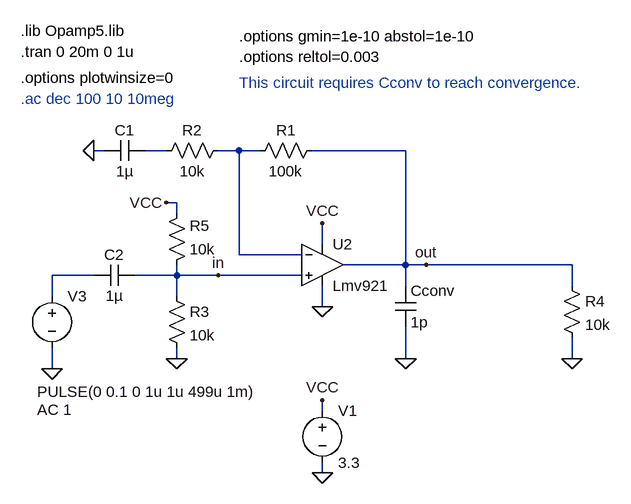
[diagram p0: schematic lmv921_test.asc]
lmv921_test.asc, the LTspice schematic file:
Version 4
SHEET 1 924 680
WIRE -224 0 -240 0
WIRE -128 0 -160 0
WIRE -16 0 -48 0
WIRE 16 0 -16 0
WIRE 240 0 96 0
WIRE -112 80 -128 80
WIRE -112 96 -112 80
WIRE 112 144 112 112
WIRE -16 160 -16 0
WIRE 80 160 -16 160
WIRE 240 176 240 0
WIRE 240 176 144 176
WIRE 272 176 240 176
WIRE 496 176 272 176
WIRE -240 192 -304 192
WIRE -112 192 -112 176
WIRE -112 192 -176 192
WIRE -48 192 -112 192
WIRE 80 192 -48 192
WIRE 240 208 240 176
WIRE 496 208 496 176
WIRE -304 224 -304 192
WIRE -112 224 -112 192
WIRE 112 240 112 208
WIRE -112 320 -112 304
WIRE 240 320 240 272
WIRE 496 320 496 288
WIRE -304 336 -304 304
WIRE 112 400 112 384
WIRE 112 496 112 480
FLAG 112 112 VCC
FLAG -304 336 0
FLAG 112 496 0
FLAG 112 384 VCC
FLAG 272 176 out
FLAG 496 320 0
FLAG -240 0 0
FLAG 112 240 0
FLAG -112 320 0
FLAG -128 80 VCC
FLAG -48 192 in
FLAG 240 320 0
SYMBOL voltage 112 384 R0
SYMATTR InstName V1
SYMATTR Value 3.3
SYMBOL res 0 16 R270
WINDOW 0 32 56 VTop 0
WINDOW 3 0 56 VBottom 0
SYMATTR InstName R1
SYMATTR Value 100k
SYMBOL res -144 16 R270
WINDOW 0 32 56 VTop 0
WINDOW 3 0 56 VBottom 0
SYMATTR InstName R2
SYMATTR Value 10k
SYMBOL voltage -304 208 R0
WINDOW 3 -23 163 Left 0
WINDOW 123 -23 191 Left 0
WINDOW 39 0 0 Left 0
SYMATTR Value PULSE(0 0.1 0 1u 1u 499u 1m)
SYMATTR Value2 AC 1
SYMATTR InstName V3
SYMBOL res 480 192 R0
SYMATTR InstName R4
SYMATTR Value 10k
SYMBOL cap -224 16 R270
WINDOW 0 32 32 VTop 0
WINDOW 3 0 32 VBottom 0
SYMATTR InstName C1
SYMATTR Value 1µ
SYMBOL res -128 192 M180
WINDOW 0 36 76 Left 0
WINDOW 3 36 40 Left 0
SYMATTR InstName R5
SYMATTR Value 10k
SYMBOL cap -240 208 R270
WINDOW 0 32 32 VTop 0
WINDOW 3 0 32 VBottom 0
SYMATTR InstName C2
SYMATTR Value 1µ
SYMBOL res -128 208 R0
SYMATTR InstName R3
SYMATTR Value 10k
SYMBOL cap 224 208 R0
SYMATTR InstName Cconv
SYMATTR Value 1p
SYMBOL Opamps\\opamp2 112 112 R0
SYMATTR InstName U2
SYMATTR Value Lmv921
TEXT -352 -184 Left 0 !.lib Opamp5.lib
TEXT -352 -152 Left 0 !.tran 0 20m 0 1u
TEXT -352 -112 Left 0 !.options plotwinsize=0
TEXT -352 -80 Left 0 ;.ac dec 100 10 10meg
TEXT -16 -176 Left 0 !.options gmin=1e-10 abstol=1e-10
TEXT -16 -144 Left 0 !.options reltol=0.003
TEXT -16 -104 Left 0 ;This circuit requires Cconv to reach convergence.

The netlist it stands for:
* lmv921_test.asc
V1 VCC 0 3.3
R1 N002 out 100k
R2 N001 N002 10k
V3 N003 0 PULSE(0 0.1 0 1u 1u 499u 1m) AC 1
R4 out 0 10k
C1 0 N001 1µ
R5 in VCC 10k
C2 N003 in 1µ
R3 in 0 10k
Cconv out 0 1p
XU2 in N002 VCC 0 out Lmv921  ; pins In+ In- V+ V- OUT
.lib Opamp5.lib
.tran 0 20m 0 1u
.options plotwinsize=0
* .ac dec 100 10 10meg
.options gmin=1e-10 abstol=1e-10
.options reltol=0.003
* This circuit requires Cconv to reach convergence.
.backanno
.end